# Altium schematic sheet History.SchDoc
size 420 x 297 mm; SheetNumber: 2; SheetTotal: 13
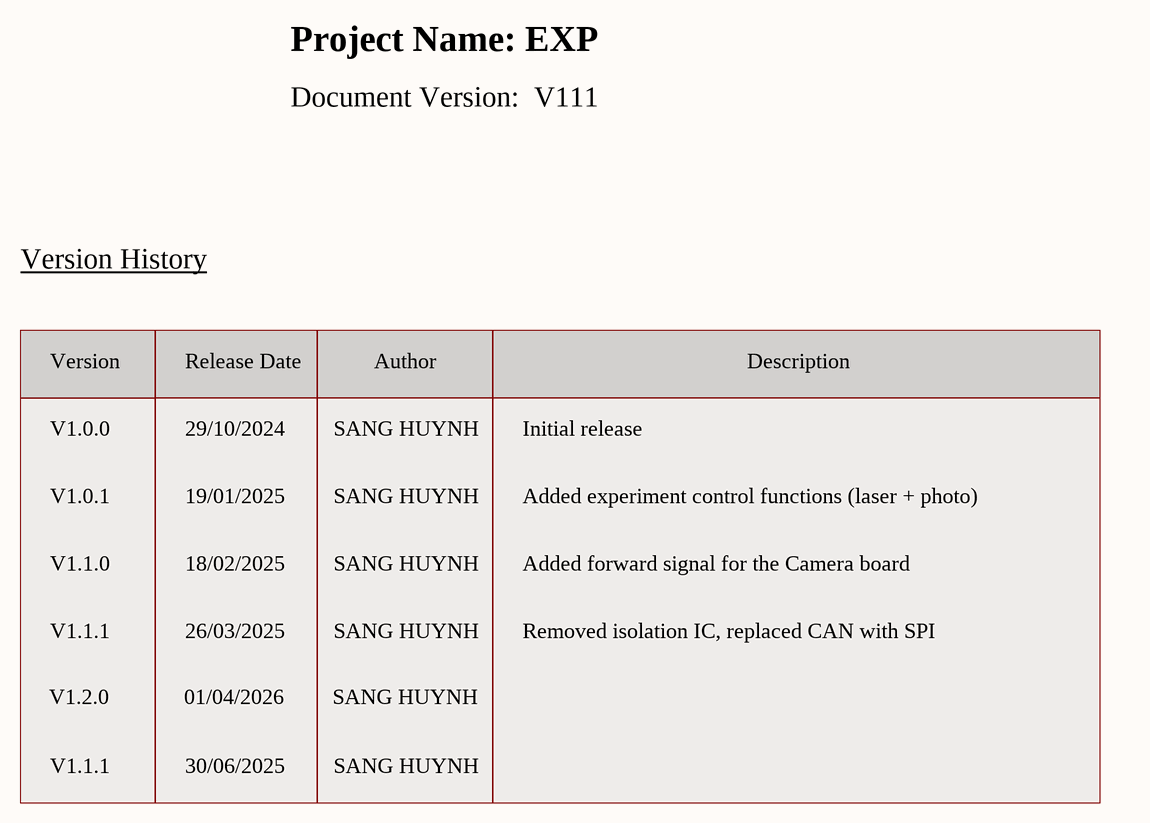
[diagram p0: History.SchDoc]

## Notes on the sheet
- Project Name: EXP
- Document Version:  V111
- Version History
- Version
- Release Date
- Author
- Description
- V1.0.0
- 29/10/2024
- SANG HUYNH
- Initial release
- V1.0.1
- 19/01/2025
- Added experiment control functions (laser + photo)
- V1.1.0
- 18/02/2025
- Added forward signal for the Camera board
- V1.1.1
- 26/03/2025
- Removed isolation IC, replaced CAN with SPI
- V1.2.0
- 01/04/2026
- 30/06/2025
- Project:
- BEE-PC1
- Sub-system:
- NANORACK_EXP_CONTROLLER
- Design by:
- BAO BUI Q.
- Sheet title:
- Sheet
- A3
- of
- Checked by:
- Approved by:
- VU PHAM
- Revision:
- Document No:
- Size:
- Date: